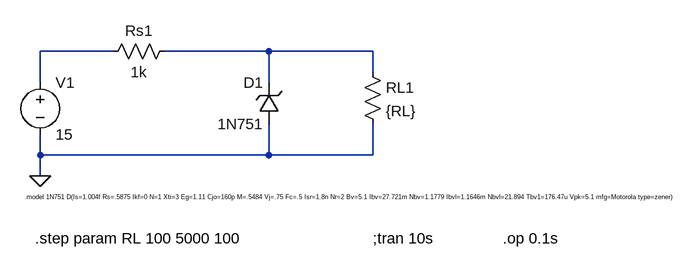
[diagram p0: schematic Zener_diode.asc]
Zener_diode.asc, the LTspice schematic file:
Version 4
SHEET 1 1908 680
WIRE 80 176 -32 176
WIRE 320 176 160 176
WIRE 480 176 320 176
WIRE 480 208 480 176
WIRE -32 224 -32 176
WIRE 320 224 320 176
WIRE -32 336 -32 304
WIRE 320 336 320 288
WIRE 320 336 -32 336
WIRE 480 336 480 288
WIRE 480 336 320 336
WIRE -32 368 -32 336
FLAG -32 368 0
SYMBOL voltage -32 208 R0
WINDOW 123 0 0 Left 0
WINDOW 39 0 0 Left 0
SYMATTR InstName V1
SYMATTR Value 15
SYMBOL res 176 160 R90
WINDOW 0 0 56 VBottom 2
WINDOW 3 32 56 VTop 2
SYMATTR InstName Rs1
SYMATTR Value 1k
SYMBOL res 464 192 R0
SYMATTR InstName RL1
SYMATTR Value {RL}
SYMBOL zener 336 288 R180
WINDOW 0 24 64 Left 2
WINDOW 3 24 0 Left 2
SYMATTR InstName D1
SYMATTR Value 1N751
SYMATTR Description Diode
SYMATTR Type diode
TEXT 480 464 Left 2 !;tran 10s
TEXT -56 400 Left 0 !.model 1N751 D(Is=1.004f Rs=.5875 Ikf=0 N=1 Xti=3 Eg=1.11 Cjo=160p M=.5484 Vj=.75 Fc=.5 Isr=1.8n Nr=2 Bv=5.1 Ibv=27.721m Nbv=1.1779 Ibvl=1.1646m Nbvl=21.894 Tbv1=176.47u Vpk=5.1 mfg=Motorola type=zener)
TEXT -40 464 Left 2 !.step param RL 100 5000 100
TEXT 680 464 Left 2 !.op 0.1s

The netlist it stands for:
* Zener_diode.asc
V1 N001 0 15
Rs1 N002 N001 1k
RL1 N002 0 {RL}
D1 0 N002 1N751
.model D D
.lib standard.dio
;tran 10s
.model 1N751 D(Is=1.004f Rs=.5875 Ikf=0 N=1 Xti=3 Eg=1.11 Cjo=160p M=.5484 Vj=.75 Fc=.5 Isr=1.8n Nr=2 Bv=5.1 Ibv=27.721m Nbv=1.1779 Ibvl=1.1646m Nbvl=21.894 Tbv1=176.47u Vpk=5.1 mfg=Motorola type=zener)
.step param RL 100 5000 100
.op 0.1s
.backanno
.end